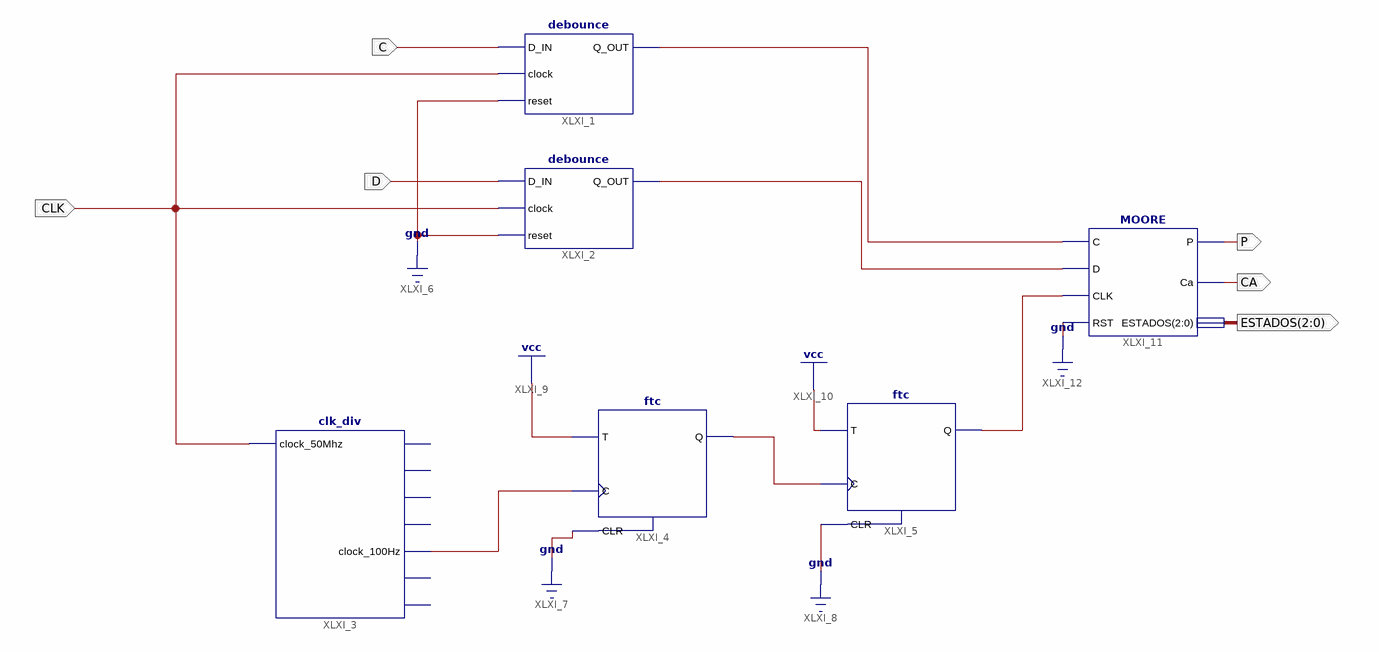
[diagram p0: schematic sheet 1]
// Xilinx ISE schematic CircuitoVojabes.sch (spartan3e) as structural Verilog: 6 symbols, 6 ports
module CircuitoVojabes (
  input  CLK,
  input  C,
  input  D,
  output P,
  output CA,
  output [2:0] ESTADOS
);

  wire XLXN_12, XLXN_14, XLXN_15, XLXN_16, XLXN_19;

  debounce XLXI_1 (.D_IN(C), .clock(CLK), .reset(1'b0), .Q_OUT(XLXN_16));
  debounce XLXI_2 (.D_IN(D), .clock(CLK), .reset(1'b0), .Q_OUT(XLXN_15));
  clk_div XLXI_3 (
    .clock_50Mhz(CLK), .clock_100Hz(XLXN_19));  // open: clock_1MHz, clock_100KHz, clock_10KHz, clock_1KHz, clock_10Hz, clock_1Hz
  ftc XLXI_4 (.C(XLXN_19), .CLR(1'b0), .T(1'b1), .Q(XLXN_12));
  ftc XLXI_5 (.C(XLXN_12), .CLR(1'b0), .T(1'b1), .Q(XLXN_14));
  MOORE XLXI_11 (.C(XLXN_16), .D(XLXN_15), .CLK(XLXN_14), .RST(1'b0), .P(P), .Ca(CA), .ESTADOS(ESTADOS));
endmodule
